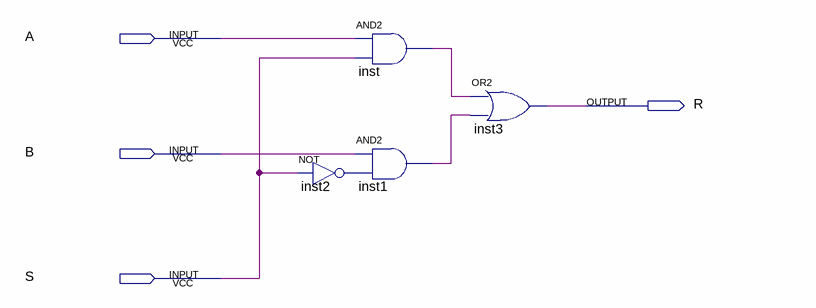
[diagram p0: schematic sheet]
// Quartus schematic Mux.bdf as structural Verilog: 4 symbols, 4 pins
module Mux (
  input  A,
  input  B,
  input  S,
  output R
);

  wire inst1_out, inst2_out, inst_out;

  and inst (inst_out, A, S);
  and inst1 (inst1_out, B, inst2_out);
  not inst2 (inst2_out, S);
  or inst3 (R, inst_out, inst1_out);
endmodule
